# EAGLE schematic Connectors (EAGLE 9.6.2)
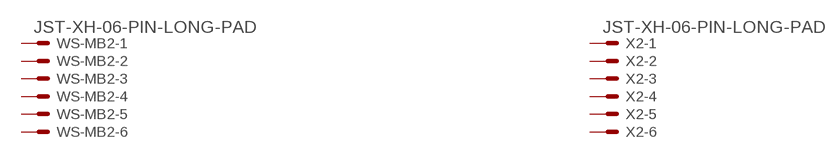
[diagram p0: schematic, sheet 1]

## Parts
WS-MB2  JST-XH-06-PIN-LONG-PAD  [JST-XH-06-PACKAGE-LONG-PAD]
X2  JST-XH-06-PIN-LONG-PAD  [JST-XH-06-PACKAGE-LONG-PAD]
Unconnected: WS-MB2.1 WS-MB2.2 WS-MB2.3 WS-MB2.4 WS-MB2.5 WS-MB2.6 X2.1 X2.2 X2.3 X2.4 X2.5 X2.6

## Library data of the parts
WS-MB2 X2 = Rembrandt Electronics - JST XH Connectors v1-0:JST-XH-06-PIN: JST XH Connector 2 Pin Wire to board connector. Pitch: 2,54 mm, (0.100") Number of pins: 6 Created by Rembrandt Electronics www.rembrandtelectronics.com